# Altium schematic sheet data_interface.SchDoc
size A4; SheetNumber: 3; SheetTotal: 6
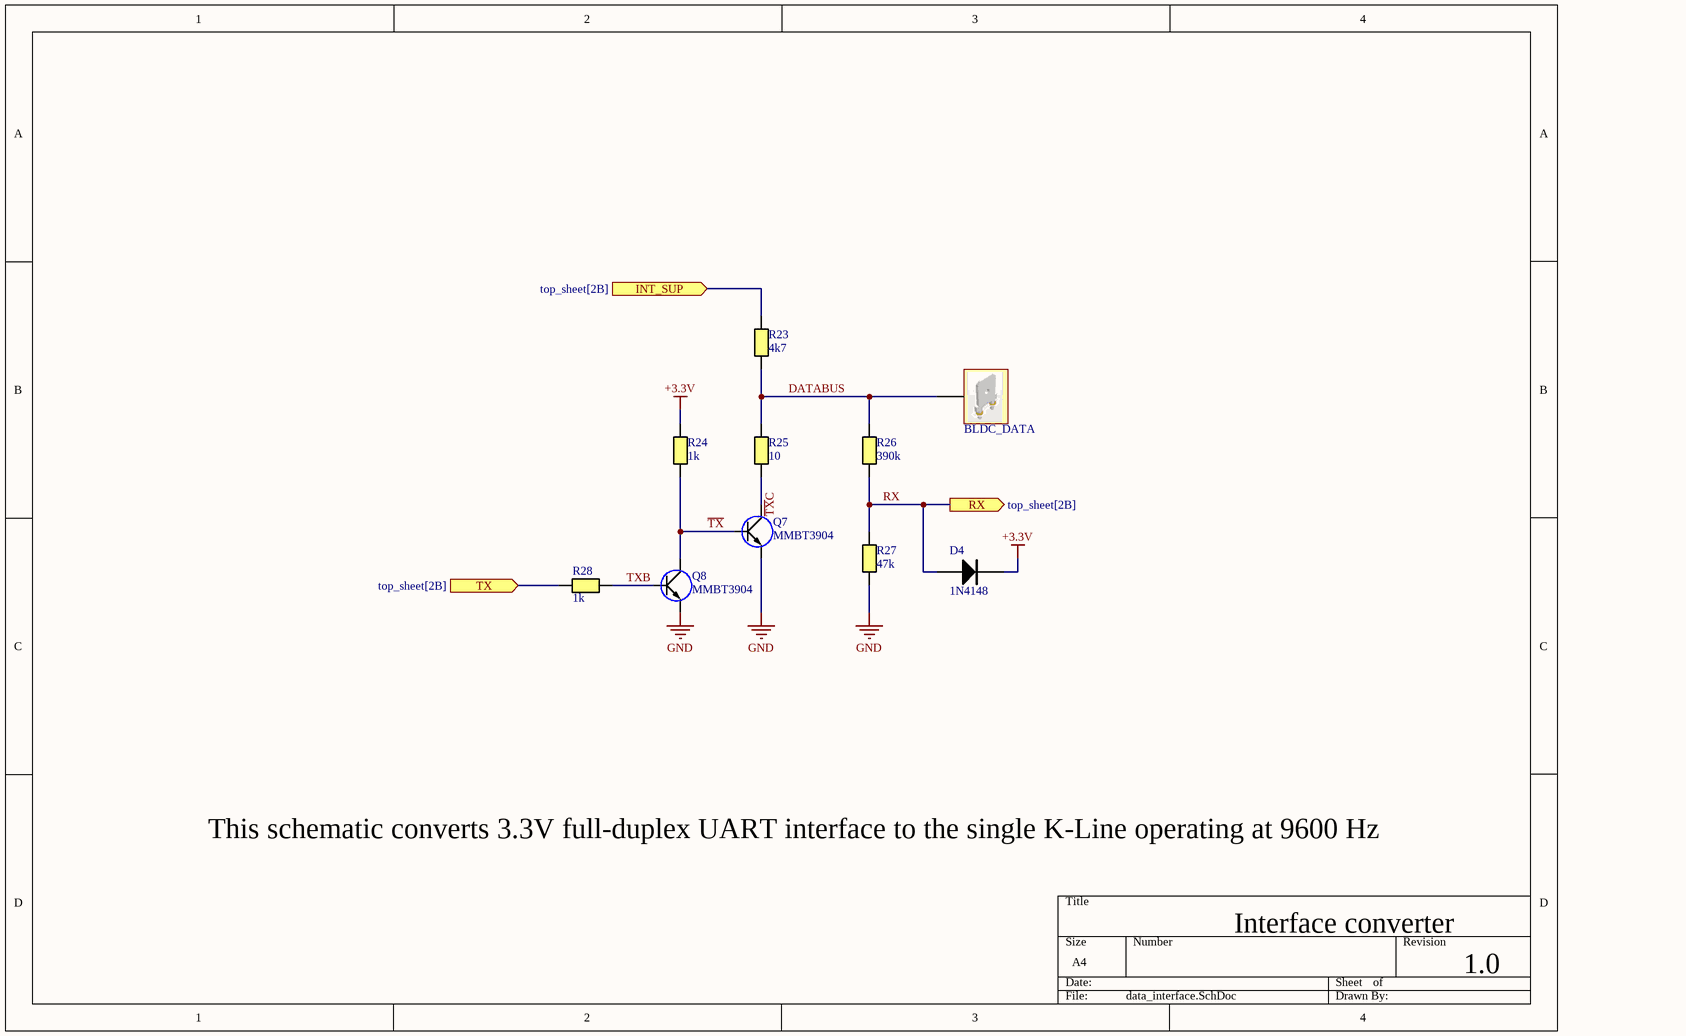
[diagram p0: data_interface.SchDoc]

## Parts
BLDC_DATA  Crimp 6.3 single PCB  [Crimp 6.3mm single PCB]  (value not drawn)
D4  1N4148  [SOD80]
Q7  MMBT3904  [SOT23]
Q8  MMBT3904  [SOT23]
R23  4k7  [RESC0603(1608)_N]
R24  1k  [RESC0603(1608)_N]
R25  10  [RESC0603(1608)_N]
R26  390k  [RESC0603(1608)_N]
R27  47k  [RESC0603(1608)_N]
R28  1k  [RESC0603(1608)_N]

## Ports
INT_SUP (in, see top_sheet[2B]), RX (out, see top_sheet[2B]), TX (in, see top_sheet[2B])

## Nets
+3.3V: D4.2(K) R24.2
GND: Q7.2(E) Q8.2(E) R27.1
DATABUS: BLDC_DATA.1 R23.1 R25.2 R26.2
INT_SUP: R23.2 ; port INT_SUP
RX: D4.1(A) R26.1 R27.2 ; port RX
~{TX}: Q7.1(B) Q8.3(C) R24.1
~{TX}C: Q7.3(C) R25.1
TX: R28.1 ; port TX
TXB: Q8.1(B) R28.2

## Notes on the sheet
- This schematic converts 3.3V full-duplex UART interface to the single K-Line operating at 9600 Hz
- Interface converter
- 1.0

## Library data of the parts
BLDC_DATA = Crimp 6.3 single PCB: Straight Mount Angle PCB Tab Terminal
D4 = 1N4148: Small Signal Fast Switching Diodes; Repetitive peak reverse voltage: 100 V; Reverse voltage: 75 V; Peak forward surge current: 2 A; Repetitive peak forward current: 500 mA; Forward continuous current: 300 mA; Average forward current: 150 mA; Diode capacitance: 4 pF; Reverse recovery time: 4 ~ 8 ns; Supplier 1: Mouser; Supplier Part Number 1: 78-MCL4148
Q7 Q8 = 2N3904: NPN General Purpose Transistor; Collector-Emitter Voltage: 40V; Collector-Base Voltage: 60V; Collector Current - Continuous: 200mA; DC Current Gain: 300
R23-R28 = Resistor M: Resistor Medium Density
  R23: Value: 4k7
  R24 R28: Value: 1k
  R25: Value: 10
  R26: Value: 390k
  R27: Value: 47k